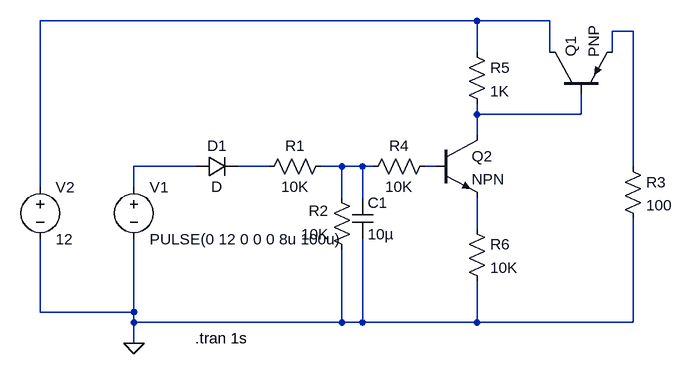
[diagram p0: schematic FanCtrlr.asc]
FanCtrlr.asc, the LTspice schematic file:
Version 4
SHEET 1 916 680
WIRE 608 -160 -64 -160
WIRE 720 -160 608 -160
WIRE 848 -144 816 -144
WIRE 608 -112 608 -160
WIRE 720 -112 720 -160
WIRE 816 -112 816 -144
WIRE 608 -16 608 -32
WIRE 768 -16 768 -48
WIRE 768 -16 608 -16
WIRE 608 16 608 -16
WIRE 176 64 80 64
WIRE 288 64 240 64
WIRE 400 64 368 64
WIRE 432 64 400 64
WIRE 448 64 432 64
WIRE 544 64 528 64
WIRE 848 64 848 -144
WIRE -64 96 -64 -160
WIRE 80 96 80 64
WIRE 400 112 400 64
WIRE 432 112 432 64
WIRE 608 160 608 112
WIRE -64 288 -64 176
WIRE 80 288 80 176
WIRE 80 288 -64 288
WIRE 80 304 80 288
WIRE 400 304 400 192
WIRE 400 304 80 304
WIRE 432 304 432 176
WIRE 432 304 400 304
WIRE 608 304 608 240
WIRE 608 304 432 304
WIRE 848 304 848 144
WIRE 848 304 608 304
WIRE 80 336 80 304
FLAG 80 336 0
SYMBOL voltage 80 80 R0
WINDOW 123 0 0 Left 2
WINDOW 39 0 0 Left 2
SYMATTR InstName V1
SYMATTR Value PULSE(0 12 0 0 0 8u 100u)
SYMBOL diode 176 80 R270
WINDOW 0 32 32 VTop 2
WINDOW 3 0 32 VBottom 2
SYMATTR InstName D1
SYMBOL res 384 48 R90
WINDOW 0 0 56 VBottom 2
WINDOW 3 32 56 VTop 2
SYMATTR InstName R1
SYMATTR Value 10K
SYMBOL cap 416 112 R0
SYMATTR InstName C1
SYMATTR Value 10µ
SYMBOL res 416 208 R180
WINDOW 0 36 76 Left 2
WINDOW 3 36 40 Left 2
SYMATTR InstName R2
SYMATTR Value 10K
SYMBOL res 832 48 R0
SYMATTR InstName R3
SYMATTR Value 100
SYMBOL voltage -64 80 R0
WINDOW 123 0 0 Left 2
WINDOW 39 0 0 Left 2
SYMATTR InstName V2
SYMATTR Value 12
SYMBOL pnp 720 -48 R270
SYMATTR InstName Q1
SYMBOL npn 544 16 R0
SYMATTR InstName Q2
SYMBOL res 544 48 R90
WINDOW 0 0 56 VBottom 2
WINDOW 3 32 56 VTop 2
SYMATTR InstName R4
SYMATTR Value 10K
SYMBOL res 592 -128 R0
SYMATTR InstName R5
SYMATTR Value 1K
SYMBOL res 592 144 R0
SYMATTR InstName R6
SYMATTR Value 10K
TEXT 174 328 Left 2 !.tran 1s

The netlist it stands for:
* FanCtrlr.asc
V1 N004 0 PULSE(0 12 0 0 0 8u 100u)
D1 N004 N005 D
R1 N006 N005 10K
C1 N006 0 10µ
R2 0 N006 10K
R3 N002 0 100
V2 N001 0 12
Q1 N001 N003 N002 0 PNP
Q2 N003 N007 N008 0 NPN
R4 N007 N006 10K
R5 N001 N003 1K
R6 N008 0 10K
.model D D
.lib standard.dio
.model NPN NPN
.model PNP PNP
.lib standard.bjt
.tran 1s
.backanno
.end